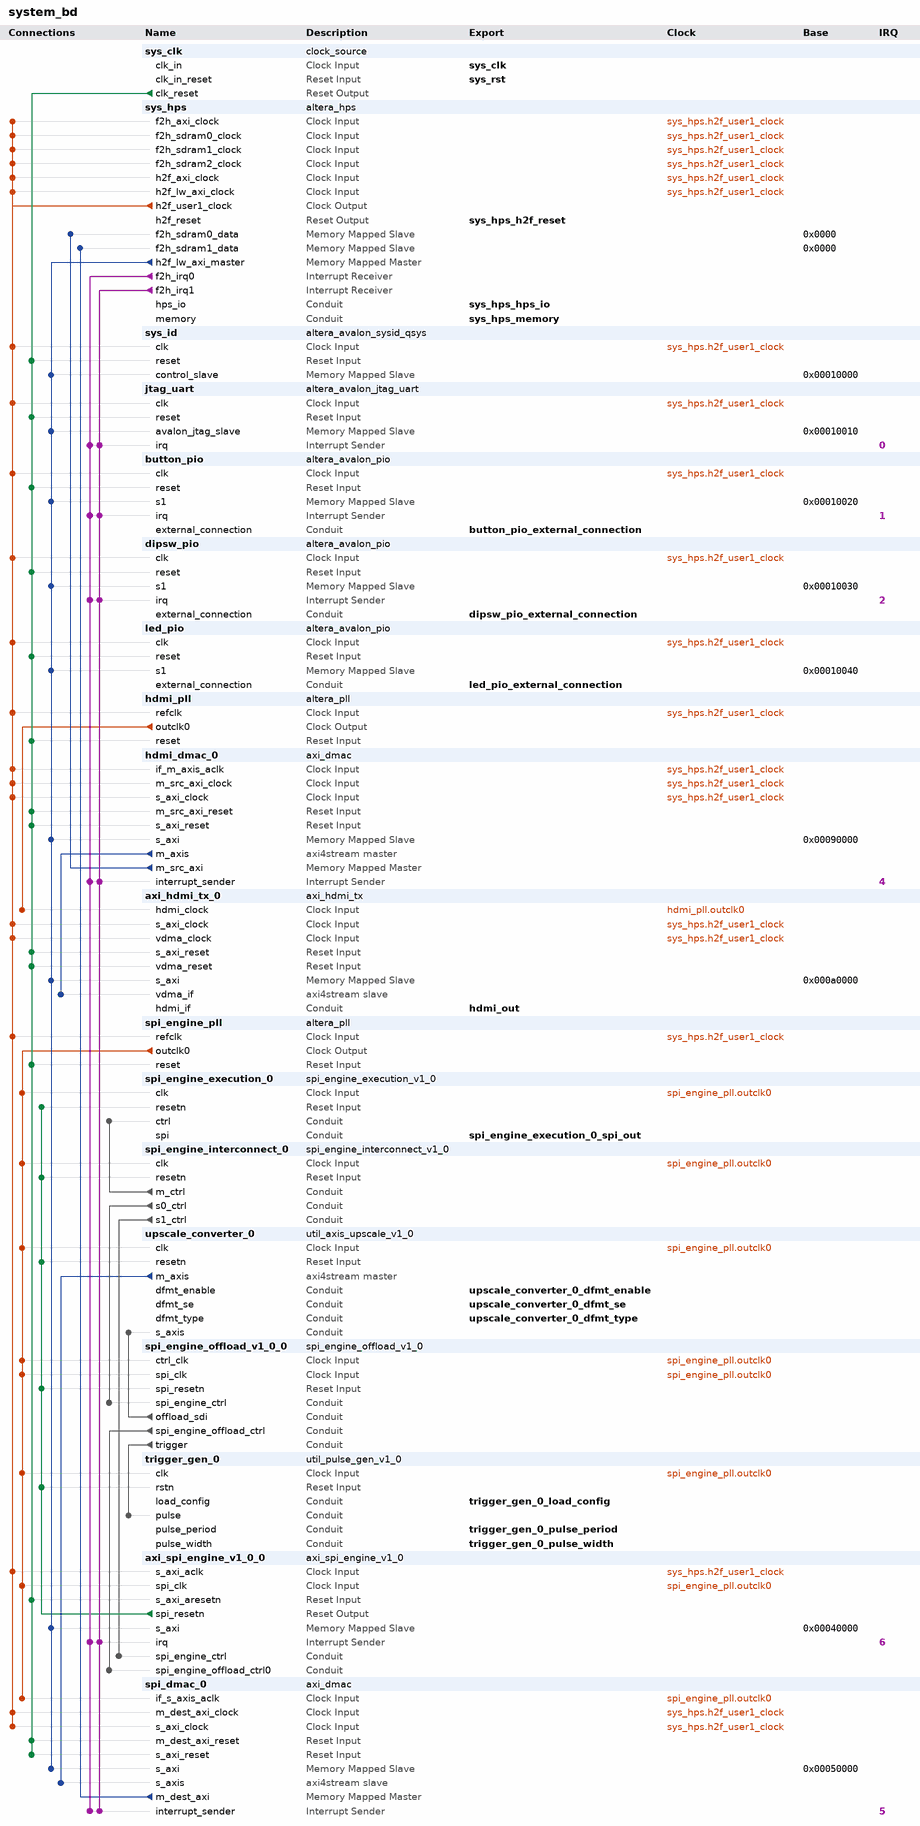
[diagram p0: system contents]
# Platform Designer (Qsys) system system_bd, Cyclone V 5CSEMA5F31C8
# Parameters at their usual value, and those the tool derives, are not listed.
package require -exact qsys 20.1
create_system system_bd
set_project_property DEVICE_FAMILY {Cyclone V}
set_project_property DEVICE 5CSEMA5F31C8

add_instance sys_clk clock_source 20.1
set_instance_parameter_value sys_clk clockFrequency 50000000

add_instance sys_hps altera_hps 20.1
set_instance_parameter_value sys_hps EMAC1_Mode RGMII
set_instance_parameter_value sys_hps EMAC1_PinMuxing {HPS I/O Set 0}
set_instance_parameter_value sys_hps F2SCLK_COLDRST_Enable false
set_instance_parameter_value sys_hps F2SCLK_DBGRST_Enable false
set_instance_parameter_value sys_hps F2SCLK_WARMRST_Enable false
set_instance_parameter_value sys_hps F2SDRAM_Type AXI-3,AXI-3,AXI-3
set_instance_parameter_value sys_hps F2SDRAM_Width 64,64,64
set_instance_parameter_value sys_hps F2SINTERRUPT_Enable true
set_instance_parameter_value sys_hps F2S_Width 2
set_instance_parameter_value sys_hps FPGA_PERIPHERAL_OUTPUT_CLOCK_FREQ_EMAC0_GTX_CLK 125
set_instance_parameter_value sys_hps FPGA_PERIPHERAL_OUTPUT_CLOCK_FREQ_EMAC0_MD_CLK 2.5
set_instance_parameter_value sys_hps FPGA_PERIPHERAL_OUTPUT_CLOCK_FREQ_EMAC1_GTX_CLK 125
set_instance_parameter_value sys_hps FPGA_PERIPHERAL_OUTPUT_CLOCK_FREQ_EMAC1_MD_CLK 2.5
set_instance_parameter_value sys_hps HPS_PROTOCOL DDR3
set_instance_parameter_value sys_hps I2C0_Mode I2C
set_instance_parameter_value sys_hps I2C0_PinMuxing {HPS I/O Set 1}
set_instance_parameter_value sys_hps I2C1_Mode I2C
set_instance_parameter_value sys_hps I2C1_PinMuxing {HPS I/O Set 0}
set_instance_parameter_value sys_hps LWH2F_Enable true
set_instance_parameter_value sys_hps MEM_BANKADDR_WIDTH 3
set_instance_parameter_value sys_hps MEM_CLK_FREQ 333.3
set_instance_parameter_value sys_hps MEM_COL_ADDR_WIDTH 10
set_instance_parameter_value sys_hps MEM_DQ_WIDTH 32
set_instance_parameter_value sys_hps MEM_DRV_STR RZQ/6
set_instance_parameter_value sys_hps MEM_ROW_ADDR_WIDTH 16
set_instance_parameter_value sys_hps MEM_RTT_NOM RZQ/6
set_instance_parameter_value sys_hps MEM_RTT_WR {Dynamic ODT off}
set_instance_parameter_value sys_hps MEM_TCL 5
set_instance_parameter_value sys_hps MEM_TFAW_NS 40.0
set_instance_parameter_value sys_hps MEM_TRAS_NS 35.0
set_instance_parameter_value sys_hps MEM_TRCD_NS 13.75
set_instance_parameter_value sys_hps MEM_TRFC_NS 350.0
set_instance_parameter_value sys_hps MEM_TRP_NS 13.75
set_instance_parameter_value sys_hps MEM_TRRD_NS 12.0
set_instance_parameter_value sys_hps MEM_TRTP_NS 12.0
set_instance_parameter_value sys_hps MEM_VENDOR JEDEC
set_instance_parameter_value sys_hps MEM_WTCL 5
set_instance_parameter_value sys_hps QSPI_Mode {1 SS}
set_instance_parameter_value sys_hps QSPI_PinMuxing {HPS I/O Set 0}
set_instance_parameter_value sys_hps REF_CLK_FREQ 25.0
set_instance_parameter_value sys_hps S2FCLK_USER1CLK_Enable true
set_instance_parameter_value sys_hps S2FCLK_USER2CLK 4
set_instance_parameter_value sys_hps S2F_Width 2
set_instance_parameter_value sys_hps SDIO_Mode {4-bit Data}
set_instance_parameter_value sys_hps SDIO_PinMuxing {HPS I/O Set 0}
set_instance_parameter_value sys_hps SPIM1_Mode N/A
set_instance_parameter_value sys_hps SPIM1_PinMuxing Unused
set_instance_parameter_value sys_hps STM_Enable false
set_instance_parameter_value sys_hps TIMING_BOARD_AC_SKEW 0.03
set_instance_parameter_value sys_hps TIMING_BOARD_AC_TO_CK_SKEW 0.0
set_instance_parameter_value sys_hps TIMING_BOARD_DQ_TO_DQS_SKEW 0.0
set_instance_parameter_value sys_hps TIMING_BOARD_MAX_CK_DELAY 0.03
set_instance_parameter_value sys_hps TIMING_BOARD_MAX_DQS_DELAY 0.02
set_instance_parameter_value sys_hps TIMING_BOARD_SKEW_BETWEEN_DQS 0.08
set_instance_parameter_value sys_hps TIMING_BOARD_SKEW_CKDQS_DIMM_MAX 0.16
set_instance_parameter_value sys_hps TIMING_BOARD_SKEW_CKDQS_DIMM_MIN 0.09
set_instance_parameter_value sys_hps TIMING_BOARD_SKEW_WITHIN_DQS 0.01
set_instance_parameter_value sys_hps TIMING_TDH 65
set_instance_parameter_value sys_hps TIMING_TDQSCK 225
set_instance_parameter_value sys_hps TIMING_TDQSQ 100
set_instance_parameter_value sys_hps TIMING_TDQSS 0.27
set_instance_parameter_value sys_hps TIMING_TDS 30
set_instance_parameter_value sys_hps TIMING_TDSH 0.18
set_instance_parameter_value sys_hps TIMING_TDSS 0.18
set_instance_parameter_value sys_hps TIMING_TIH 140
set_instance_parameter_value sys_hps TIMING_TIS 180
set_instance_parameter_value sys_hps TIMING_TQSH 0.4
set_instance_parameter_value sys_hps UART0_Mode {No Flow Control}
set_instance_parameter_value sys_hps UART0_PinMuxing {HPS I/O Set 0}
set_instance_parameter_value sys_hps USB1_Mode SDR
set_instance_parameter_value sys_hps USB1_PinMuxing {HPS I/O Set 0}
set_instance_parameter_value sys_hps desired_cfg_clk_mhz 80.0
set_instance_parameter_value sys_hps desired_qspi_clk_mhz 400.0

add_instance sys_id altera_avalon_sysid_qsys 20.1
set_instance_parameter_value sys_id id -1395322110

add_instance jtag_uart altera_avalon_jtag_uart 20.1
set_instance_parameter_value jtag_uart simInteractiveOptions NO_INTERACTIVE_WINDOWS

add_instance button_pio altera_avalon_pio 20.1
set_instance_parameter_value button_pio captureEdge true
set_instance_parameter_value button_pio direction Input
set_instance_parameter_value button_pio edgeType FALLING
set_instance_parameter_value button_pio generateIRQ true
set_instance_parameter_value button_pio irqType EDGE
set_instance_parameter_value button_pio width 1

add_instance dipsw_pio altera_avalon_pio 20.1
set_instance_parameter_value dipsw_pio bitClearingEdgeCapReg true
set_instance_parameter_value dipsw_pio captureEdge true
set_instance_parameter_value dipsw_pio direction Input
set_instance_parameter_value dipsw_pio edgeType ANY
set_instance_parameter_value dipsw_pio generateIRQ true
set_instance_parameter_value dipsw_pio width 2

add_instance led_pio altera_avalon_pio 20.1
set_instance_parameter_value led_pio direction Output
set_instance_parameter_value led_pio width 2

add_instance hdmi_pll altera_pll 20.1
set_instance_parameter_value hdmi_pll gui_device_speed_grade 2
set_instance_parameter_value hdmi_pll gui_number_of_clocks 1
set_instance_parameter_value hdmi_pll gui_operation_mode direct
set_instance_parameter_value hdmi_pll gui_output_clock_frequency0 148.5
set_instance_parameter_value hdmi_pll gui_pll_mode {Integer-N PLL}
set_instance_parameter_value hdmi_pll gui_reference_clock_frequency 100.0
set_instance_parameter_value hdmi_pll gui_use_locked false

add_instance hdmi_dmac_0 axi_dmac 1.0
set_instance_parameter_value hdmi_dmac_0 ASYNC_CLK_DEST_REQ_MANUAL 1
set_instance_parameter_value hdmi_dmac_0 ASYNC_CLK_REQ_SRC_MANUAL 1
set_instance_parameter_value hdmi_dmac_0 ASYNC_CLK_SRC_DEST_MANUAL 1
set_instance_parameter_value hdmi_dmac_0 AXI_SLICE_DEST 0
set_instance_parameter_value hdmi_dmac_0 AXI_SLICE_SRC 0
set_instance_parameter_value hdmi_dmac_0 CLK_DOMAIN_DEST_AXI 0
set_instance_parameter_value hdmi_dmac_0 CLK_DOMAIN_DEST_FIFO 0
set_instance_parameter_value hdmi_dmac_0 CLK_DOMAIN_DEST_SAXI 7
set_instance_parameter_value hdmi_dmac_0 CLK_DOMAIN_REQ 7
set_instance_parameter_value hdmi_dmac_0 CLK_DOMAIN_SRC_AXI 7
set_instance_parameter_value hdmi_dmac_0 CLK_DOMAIN_SRC_FIFO 0
set_instance_parameter_value hdmi_dmac_0 CLK_DOMAIN_SRC_SAXI 0
set_instance_parameter_value hdmi_dmac_0 CYCLIC 1
set_instance_parameter_value hdmi_dmac_0 DISABLE_DEBUG_REGISTERS 0
set_instance_parameter_value hdmi_dmac_0 DMA_2D_TRANSFER 1
set_instance_parameter_value hdmi_dmac_0 DMA_AXIS_DEST_W 4
set_instance_parameter_value hdmi_dmac_0 DMA_AXIS_ID_W 8
set_instance_parameter_value hdmi_dmac_0 DMA_AXI_PROTOCOL_DEST 1
set_instance_parameter_value hdmi_dmac_0 DMA_AXI_PROTOCOL_SRC 1
set_instance_parameter_value hdmi_dmac_0 DMA_DATA_WIDTH_DEST 64
set_instance_parameter_value hdmi_dmac_0 DMA_DATA_WIDTH_SRC 64
set_instance_parameter_value hdmi_dmac_0 DMA_LENGTH_WIDTH 24
set_instance_parameter_value hdmi_dmac_0 DMA_TYPE_DEST 1
set_instance_parameter_value hdmi_dmac_0 DMA_TYPE_SRC 0
set_instance_parameter_value hdmi_dmac_0 ENABLE_DIAGNOSTICS_IF 0
set_instance_parameter_value hdmi_dmac_0 FIFO_SIZE 8
set_instance_parameter_value hdmi_dmac_0 HAS_AXIS_TDEST 0
set_instance_parameter_value hdmi_dmac_0 HAS_AXIS_TID 0
set_instance_parameter_value hdmi_dmac_0 HAS_AXIS_TKEEP 0
set_instance_parameter_value hdmi_dmac_0 HAS_AXIS_TLAST 1
set_instance_parameter_value hdmi_dmac_0 HAS_AXIS_TSTRB 0
set_instance_parameter_value hdmi_dmac_0 HAS_AXIS_TUSER 0
set_instance_parameter_value hdmi_dmac_0 ID 0
set_instance_parameter_value hdmi_dmac_0 MAX_BYTES_PER_BURST 128
set_instance_parameter_value hdmi_dmac_0 SYNC_TRANSFER_START 0

add_instance axi_hdmi_tx_0 axi_hdmi_tx 1.0
set_instance_parameter_value axi_hdmi_tx_0 CR_CB_N 0
set_instance_parameter_value axi_hdmi_tx_0 FPGA_TECHNOLOGY 101
set_instance_parameter_value axi_hdmi_tx_0 ID 0
set_instance_parameter_value axi_hdmi_tx_0 INTERFACE 16_BIT
set_instance_parameter_value axi_hdmi_tx_0 OUT_CLK_POLARITY 0

add_instance spi_engine_pll altera_pll 20.1
set_instance_parameter_value spi_engine_pll gui_device_speed_grade 2
set_instance_parameter_value spi_engine_pll gui_number_of_clocks 1
set_instance_parameter_value spi_engine_pll gui_operation_mode direct
set_instance_parameter_value spi_engine_pll gui_output_clock_frequency0 166.667
set_instance_parameter_value spi_engine_pll gui_pll_mode {Integer-N PLL}
set_instance_parameter_value spi_engine_pll gui_reference_clock_frequency 100.0
set_instance_parameter_value spi_engine_pll gui_use_locked true

add_instance spi_engine_execution_0 spi_engine_execution_v1_0 1.0
set_instance_parameter_value spi_engine_execution_0 DATA_WIDTH 20
set_instance_parameter_value spi_engine_execution_0 DEFAULT_CLK_DIV 0
set_instance_parameter_value spi_engine_execution_0 DEFAULT_SPI_CFG 0
set_instance_parameter_value spi_engine_execution_0 NUM_OF_CS 1
set_instance_parameter_value spi_engine_execution_0 NUM_OF_SDI 1
set_instance_parameter_value spi_engine_execution_0 SDI_DELAY 2
set_instance_parameter_value spi_engine_execution_0 SDO_DEFAULT 1

add_instance spi_engine_interconnect_0 spi_engine_interconnect_v1_0 1.0
set_instance_parameter_value spi_engine_interconnect_0 DATA_WIDTH 20
set_instance_parameter_value spi_engine_interconnect_0 NUM_OF_SDI 1

add_instance upscale_converter_0 util_axis_upscale_v1_0 1.0
set_instance_parameter_value upscale_converter_0 DATA_WIDTH 24
set_instance_parameter_value upscale_converter_0 NUM_OF_CHANNELS 1
set_instance_parameter_value upscale_converter_0 UDATA_WIDTH 32

add_instance spi_engine_offload_v1_0_0 spi_engine_offload_v1_0 1.0
set_instance_parameter_value spi_engine_offload_v1_0_0 ASYNC_SPI_CLK 1
set_instance_parameter_value spi_engine_offload_v1_0_0 ASYNC_TRIG 0
set_instance_parameter_value spi_engine_offload_v1_0_0 CMD_MEM_ADDRESS_WIDTH 4
set_instance_parameter_value spi_engine_offload_v1_0_0 DATA_WIDTH 20
set_instance_parameter_value spi_engine_offload_v1_0_0 NUM_OF_SDI 1
set_instance_parameter_value spi_engine_offload_v1_0_0 SDO_MEM_ADDRESS_WIDTH 4

add_instance trigger_gen_0 util_pulse_gen_v1_0 1.0
set_instance_parameter_value trigger_gen_0 PULSE_PERIOD 93
set_instance_parameter_value trigger_gen_0 PULSE_WIDTH 1

add_instance axi_spi_engine_v1_0_0 axi_spi_engine_v1_0 1.1
set_instance_parameter_value axi_spi_engine_v1_0_0 ASYNC_SPI_CLK 1
set_instance_parameter_value axi_spi_engine_v1_0_0 CMD_FIFO_ADDRESS_WIDTH 4
set_instance_parameter_value axi_spi_engine_v1_0_0 DATA_WIDTH 20
set_instance_parameter_value axi_spi_engine_v1_0_0 ID 0
set_instance_parameter_value axi_spi_engine_v1_0_0 MM_IF_TYPE 0
set_instance_parameter_value axi_spi_engine_v1_0_0 NUM_OFFLOAD 1
set_instance_parameter_value axi_spi_engine_v1_0_0 NUM_OF_SDI 1
set_instance_parameter_value axi_spi_engine_v1_0_0 OFFLOAD0_CMD_MEM_ADDRESS_WIDTH 4
set_instance_parameter_value axi_spi_engine_v1_0_0 OFFLOAD0_SDO_MEM_ADDRESS_WIDTH 4
set_instance_parameter_value axi_spi_engine_v1_0_0 SDI_FIFO_ADDRESS_WIDTH 5
set_instance_parameter_value axi_spi_engine_v1_0_0 SDO_FIFO_ADDRESS_WIDTH 5
set_instance_parameter_value axi_spi_engine_v1_0_0 SYNC_FIFO_ADDRESS_WIDTH 4

add_instance spi_dmac_0 axi_dmac 1.0
set_instance_parameter_value spi_dmac_0 ASYNC_CLK_DEST_REQ_MANUAL 1
set_instance_parameter_value spi_dmac_0 ASYNC_CLK_REQ_SRC_MANUAL 1
set_instance_parameter_value spi_dmac_0 ASYNC_CLK_SRC_DEST_MANUAL 1
set_instance_parameter_value spi_dmac_0 AXI_SLICE_DEST 1
set_instance_parameter_value spi_dmac_0 AXI_SLICE_SRC 0
set_instance_parameter_value spi_dmac_0 CLK_DOMAIN_DEST_AXI 7
set_instance_parameter_value spi_dmac_0 CLK_DOMAIN_DEST_FIFO 0
set_instance_parameter_value spi_dmac_0 CLK_DOMAIN_DEST_SAXI 0
set_instance_parameter_value spi_dmac_0 CLK_DOMAIN_REQ 7
set_instance_parameter_value spi_dmac_0 CLK_DOMAIN_SRC_AXI 0
set_instance_parameter_value spi_dmac_0 CLK_DOMAIN_SRC_FIFO 0
set_instance_parameter_value spi_dmac_0 CLK_DOMAIN_SRC_SAXI 6
set_instance_parameter_value spi_dmac_0 CYCLIC 0
set_instance_parameter_value spi_dmac_0 DISABLE_DEBUG_REGISTERS 0
set_instance_parameter_value spi_dmac_0 DMA_2D_TRANSFER 0
set_instance_parameter_value spi_dmac_0 DMA_AXIS_DEST_W 4
set_instance_parameter_value spi_dmac_0 DMA_AXIS_ID_W 8
set_instance_parameter_value spi_dmac_0 DMA_AXI_PROTOCOL_DEST 1
set_instance_parameter_value spi_dmac_0 DMA_AXI_PROTOCOL_SRC 1
set_instance_parameter_value spi_dmac_0 DMA_DATA_WIDTH_DEST 64
set_instance_parameter_value spi_dmac_0 DMA_DATA_WIDTH_SRC 32
set_instance_parameter_value spi_dmac_0 DMA_LENGTH_WIDTH 24
set_instance_parameter_value spi_dmac_0 DMA_TYPE_DEST 0
set_instance_parameter_value spi_dmac_0 DMA_TYPE_SRC 1
set_instance_parameter_value spi_dmac_0 ENABLE_DIAGNOSTICS_IF 0
set_instance_parameter_value spi_dmac_0 FIFO_SIZE 8
set_instance_parameter_value spi_dmac_0 HAS_AXIS_TDEST 0
set_instance_parameter_value spi_dmac_0 HAS_AXIS_TID 0
set_instance_parameter_value spi_dmac_0 HAS_AXIS_TKEEP 0
set_instance_parameter_value spi_dmac_0 HAS_AXIS_TLAST 0
set_instance_parameter_value spi_dmac_0 HAS_AXIS_TSTRB 0
set_instance_parameter_value spi_dmac_0 HAS_AXIS_TUSER 0
set_instance_parameter_value spi_dmac_0 ID 0
set_instance_parameter_value spi_dmac_0 MAX_BYTES_PER_BURST 128
set_instance_parameter_value spi_dmac_0 SYNC_TRANSFER_START 0

# connections
add_connection hdmi_pll.outclk0 axi_hdmi_tx_0.hdmi_clock clock
add_connection spi_engine_pll.outclk0 axi_spi_engine_v1_0_0.spi_clk clock
add_connection spi_engine_pll.outclk0 spi_dmac_0.if_s_axis_aclk clock
add_connection spi_engine_pll.outclk0 spi_engine_execution_0.clk clock
add_connection spi_engine_pll.outclk0 spi_engine_interconnect_0.clk clock
add_connection spi_engine_pll.outclk0 spi_engine_offload_v1_0_0.ctrl_clk clock
add_connection spi_engine_pll.outclk0 spi_engine_offload_v1_0_0.spi_clk clock
add_connection spi_engine_pll.outclk0 trigger_gen_0.clk clock
add_connection spi_engine_pll.outclk0 upscale_converter_0.clk clock
add_connection sys_hps.h2f_user1_clock axi_hdmi_tx_0.s_axi_clock clock
add_connection sys_hps.h2f_user1_clock axi_hdmi_tx_0.vdma_clock clock
add_connection sys_hps.h2f_user1_clock axi_spi_engine_v1_0_0.s_axi_aclk clock
add_connection sys_hps.h2f_user1_clock button_pio.clk clock
add_connection sys_hps.h2f_user1_clock dipsw_pio.clk clock
add_connection sys_hps.h2f_user1_clock hdmi_dmac_0.if_m_axis_aclk clock
add_connection sys_hps.h2f_user1_clock hdmi_dmac_0.m_src_axi_clock clock
add_connection sys_hps.h2f_user1_clock hdmi_dmac_0.s_axi_clock clock
add_connection sys_hps.h2f_user1_clock hdmi_pll.refclk clock
add_connection sys_hps.h2f_user1_clock jtag_uart.clk clock
add_connection sys_hps.h2f_user1_clock led_pio.clk clock
add_connection sys_hps.h2f_user1_clock spi_dmac_0.m_dest_axi_clock clock
add_connection sys_hps.h2f_user1_clock spi_dmac_0.s_axi_clock clock
add_connection sys_hps.h2f_user1_clock spi_engine_pll.refclk clock
add_connection sys_hps.h2f_user1_clock sys_hps.f2h_axi_clock clock
add_connection sys_hps.h2f_user1_clock sys_hps.f2h_sdram0_clock clock
add_connection sys_hps.h2f_user1_clock sys_hps.f2h_sdram1_clock clock
add_connection sys_hps.h2f_user1_clock sys_hps.f2h_sdram2_clock clock
add_connection sys_hps.h2f_user1_clock sys_hps.h2f_axi_clock clock
add_connection sys_hps.h2f_user1_clock sys_hps.h2f_lw_axi_clock clock
add_connection sys_hps.h2f_user1_clock sys_id.clk clock
add_connection axi_spi_engine_v1_0_0.spi_resetn spi_engine_execution_0.resetn reset
add_connection axi_spi_engine_v1_0_0.spi_resetn spi_engine_interconnect_0.resetn reset
add_connection axi_spi_engine_v1_0_0.spi_resetn spi_engine_offload_v1_0_0.spi_resetn reset
add_connection axi_spi_engine_v1_0_0.spi_resetn trigger_gen_0.rstn reset
add_connection axi_spi_engine_v1_0_0.spi_resetn upscale_converter_0.resetn reset
add_connection sys_clk.clk_reset axi_hdmi_tx_0.s_axi_reset reset
add_connection sys_clk.clk_reset axi_hdmi_tx_0.vdma_reset reset
add_connection sys_clk.clk_reset axi_spi_engine_v1_0_0.s_axi_aresetn reset
add_connection sys_clk.clk_reset button_pio.reset reset
add_connection sys_clk.clk_reset dipsw_pio.reset reset
add_connection sys_clk.clk_reset hdmi_dmac_0.m_src_axi_reset reset
add_connection sys_clk.clk_reset hdmi_dmac_0.s_axi_reset reset
add_connection sys_clk.clk_reset hdmi_pll.reset reset
add_connection sys_clk.clk_reset jtag_uart.reset reset
add_connection sys_clk.clk_reset led_pio.reset reset
add_connection sys_clk.clk_reset spi_dmac_0.m_dest_axi_reset reset
add_connection sys_clk.clk_reset spi_dmac_0.s_axi_reset reset
add_connection sys_clk.clk_reset spi_engine_pll.reset reset
add_connection sys_clk.clk_reset sys_id.reset reset
add_connection hdmi_dmac_0.m_src_axi sys_hps.f2h_sdram0_data avalon
set_connection_parameter_value hdmi_dmac_0.m_src_axi/sys_hps.f2h_sdram0_data baseAddress 0x0000
add_connection spi_dmac_0.m_dest_axi sys_hps.f2h_sdram1_data avalon
set_connection_parameter_value spi_dmac_0.m_dest_axi/sys_hps.f2h_sdram1_data baseAddress 0x0000
add_connection sys_hps.h2f_lw_axi_master axi_hdmi_tx_0.s_axi avalon
set_connection_parameter_value sys_hps.h2f_lw_axi_master/axi_hdmi_tx_0.s_axi baseAddress 0x000a0000
add_connection sys_hps.h2f_lw_axi_master axi_spi_engine_v1_0_0.s_axi avalon
set_connection_parameter_value sys_hps.h2f_lw_axi_master/axi_spi_engine_v1_0_0.s_axi baseAddress 0x00040000
add_connection sys_hps.h2f_lw_axi_master button_pio.s1 avalon
set_connection_parameter_value sys_hps.h2f_lw_axi_master/button_pio.s1 baseAddress 0x00010020
add_connection sys_hps.h2f_lw_axi_master dipsw_pio.s1 avalon
set_connection_parameter_value sys_hps.h2f_lw_axi_master/dipsw_pio.s1 baseAddress 0x00010030
add_connection sys_hps.h2f_lw_axi_master hdmi_dmac_0.s_axi avalon
set_connection_parameter_value sys_hps.h2f_lw_axi_master/hdmi_dmac_0.s_axi baseAddress 0x00090000
add_connection sys_hps.h2f_lw_axi_master jtag_uart.avalon_jtag_slave avalon
set_connection_parameter_value sys_hps.h2f_lw_axi_master/jtag_uart.avalon_jtag_slave baseAddress 0x00010010
add_connection sys_hps.h2f_lw_axi_master led_pio.s1 avalon
set_connection_parameter_value sys_hps.h2f_lw_axi_master/led_pio.s1 baseAddress 0x00010040
add_connection sys_hps.h2f_lw_axi_master spi_dmac_0.s_axi avalon
set_connection_parameter_value sys_hps.h2f_lw_axi_master/spi_dmac_0.s_axi baseAddress 0x00050000
add_connection sys_hps.h2f_lw_axi_master sys_id.control_slave avalon
set_connection_parameter_value sys_hps.h2f_lw_axi_master/sys_id.control_slave baseAddress 0x00010000
add_connection hdmi_dmac_0.m_axis axi_hdmi_tx_0.vdma_if axi4stream
add_connection upscale_converter_0.m_axis spi_dmac_0.s_axis axi4stream
add_connection spi_engine_interconnect_0.m_ctrl spi_engine_execution_0.ctrl conduit
add_connection spi_engine_interconnect_0.s0_ctrl spi_engine_offload_v1_0_0.spi_engine_ctrl conduit
add_connection spi_engine_interconnect_0.s1_ctrl axi_spi_engine_v1_0_0.spi_engine_ctrl conduit
add_connection spi_engine_offload_v1_0_0.offload_sdi upscale_converter_0.s_axis conduit
add_connection spi_engine_offload_v1_0_0.spi_engine_offload_ctrl axi_spi_engine_v1_0_0.spi_engine_offload_ctrl0 conduit
add_connection spi_engine_offload_v1_0_0.trigger trigger_gen_0.pulse conduit
add_connection sys_hps.f2h_irq0 axi_spi_engine_v1_0_0.irq interrupt
set_connection_parameter_value sys_hps.f2h_irq0/axi_spi_engine_v1_0_0.irq irqNumber 6
add_connection sys_hps.f2h_irq0 button_pio.irq interrupt
set_connection_parameter_value sys_hps.f2h_irq0/button_pio.irq irqNumber 1
add_connection sys_hps.f2h_irq0 dipsw_pio.irq interrupt
set_connection_parameter_value sys_hps.f2h_irq0/dipsw_pio.irq irqNumber 2
add_connection sys_hps.f2h_irq0 hdmi_dmac_0.interrupt_sender interrupt
set_connection_parameter_value sys_hps.f2h_irq0/hdmi_dmac_0.interrupt_sender irqNumber 4
add_connection sys_hps.f2h_irq0 jtag_uart.irq interrupt
set_connection_parameter_value sys_hps.f2h_irq0/jtag_uart.irq irqNumber 0
add_connection sys_hps.f2h_irq0 spi_dmac_0.interrupt_sender interrupt
set_connection_parameter_value sys_hps.f2h_irq0/spi_dmac_0.interrupt_sender irqNumber 5
add_connection sys_hps.f2h_irq1 axi_spi_engine_v1_0_0.irq interrupt
set_connection_parameter_value sys_hps.f2h_irq1/axi_spi_engine_v1_0_0.irq irqNumber 6
add_connection sys_hps.f2h_irq1 button_pio.irq interrupt
set_connection_parameter_value sys_hps.f2h_irq1/button_pio.irq irqNumber 1
add_connection sys_hps.f2h_irq1 dipsw_pio.irq interrupt
set_connection_parameter_value sys_hps.f2h_irq1/dipsw_pio.irq irqNumber 2
add_connection sys_hps.f2h_irq1 hdmi_dmac_0.interrupt_sender interrupt
set_connection_parameter_value sys_hps.f2h_irq1/hdmi_dmac_0.interrupt_sender irqNumber 4
add_connection sys_hps.f2h_irq1 jtag_uart.irq interrupt
set_connection_parameter_value sys_hps.f2h_irq1/jtag_uart.irq irqNumber 0
add_connection sys_hps.f2h_irq1 spi_dmac_0.interrupt_sender interrupt
set_connection_parameter_value sys_hps.f2h_irq1/spi_dmac_0.interrupt_sender irqNumber 5

# exported interfaces
add_interface button_pio_external_connection conduit end
set_interface_property button_pio_external_connection EXPORT_OF button_pio.external_connection
add_interface dipsw_pio_external_connection conduit end
set_interface_property dipsw_pio_external_connection EXPORT_OF dipsw_pio.external_connection
add_interface hdmi_out conduit end
set_interface_property hdmi_out EXPORT_OF axi_hdmi_tx_0.hdmi_if
add_interface led_pio_external_connection conduit end
set_interface_property led_pio_external_connection EXPORT_OF led_pio.external_connection
add_interface spi_engine_execution_0_spi_out conduit end
set_interface_property spi_engine_execution_0_spi_out EXPORT_OF spi_engine_execution_0.spi
add_interface sys_clk clock sink
set_interface_property sys_clk EXPORT_OF sys_clk.clk_in
add_interface sys_hps_h2f_reset reset source
set_interface_property sys_hps_h2f_reset EXPORT_OF sys_hps.h2f_reset
add_interface sys_hps_hps_io conduit end
set_interface_property sys_hps_hps_io EXPORT_OF sys_hps.hps_io
add_interface sys_hps_memory conduit end
set_interface_property sys_hps_memory EXPORT_OF sys_hps.memory
add_interface sys_rst reset sink
set_interface_property sys_rst EXPORT_OF sys_clk.clk_in_reset
add_interface trigger_gen_0_load_config conduit end
set_interface_property trigger_gen_0_load_config EXPORT_OF trigger_gen_0.load_config
add_interface trigger_gen_0_pulse_period conduit end
set_interface_property trigger_gen_0_pulse_period EXPORT_OF trigger_gen_0.pulse_period
add_interface trigger_gen_0_pulse_width conduit end
set_interface_property trigger_gen_0_pulse_width EXPORT_OF trigger_gen_0.pulse_width
add_interface upscale_converter_0_dfmt_enable conduit end
set_interface_property upscale_converter_0_dfmt_enable EXPORT_OF upscale_converter_0.dfmt_enable
add_interface upscale_converter_0_dfmt_se conduit end
set_interface_property upscale_converter_0_dfmt_se EXPORT_OF upscale_converter_0.dfmt_se
add_interface upscale_converter_0_dfmt_type conduit end
set_interface_property upscale_converter_0_dfmt_type EXPORT_OF upscale_converter_0.dfmt_type

set_interconnect_requirement {$system} qsys_mm.burstAdapterImplementation PER_BURST_TYPE_CONVERTER
set_interconnect_requirement {$system} qsys_mm.clockCrossingAdapter AUTO
set_interconnect_requirement {$system} qsys_mm.maxAdditionalLatency 4

save_system system_bd.qsys
